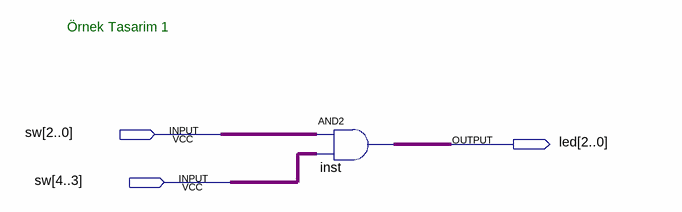
[diagram p0: schematic sheet]
// Quartus schematic ornek1_top.bdf as structural Verilog: 1 symbols, 3 pins
module ornek1_top (
  input  [4:0] sw,
  output [2:0] led
);

  assign led = sw[2:0] & sw[4:3];  // AND2 inst, 3 bits wide

  // Notes on the sheet:
  //   Örnek Tasarim 1
endmodule
